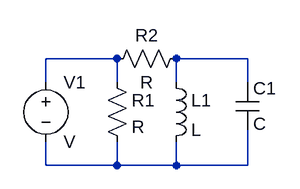
[diagram p0: schematic Katie.asc]
Katie.asc, the LTspice schematic file:
Version 4
SHEET 1 880 680
WIRE 144 96 48 96
WIRE 320 96 224 96
WIRE 48 128 48 96
WIRE 144 128 144 96
WIRE 224 128 224 96
WIRE 320 128 320 96
WIRE 48 240 48 208
WIRE 144 240 144 208
WIRE 144 240 48 240
WIRE 224 240 224 208
WIRE 224 240 144 240
WIRE 320 240 320 192
WIRE 320 240 224 240
SYMBOL voltage 48 112 R0
SYMATTR InstName V1
SYMBOL res 128 112 R0
SYMATTR InstName R1
SYMBOL ind 208 112 R0
SYMATTR InstName L1
SYMBOL cap 304 128 R0
SYMATTR InstName C1
SYMBOL res 240 80 R90
WINDOW 0 0 56 VBottom 2
WINDOW 3 32 56 VTop 2
SYMATTR InstName R2

The netlist it stands for:
* Katie.asc
V1 N001 N003 V
R1 N001 N003 R
L1 N002 N003 L
C1 N002 N003 C
R2 N002 N001 R
.backanno
.end